# EasyEDA schematic LCD News Ticker.json
TITLE: LCD News Ticker; REV: 1.0; Date: 2021-03-30; Sheet: 1/1; Drawn By: Ferrie Bank; Company: Oude Snepelaar
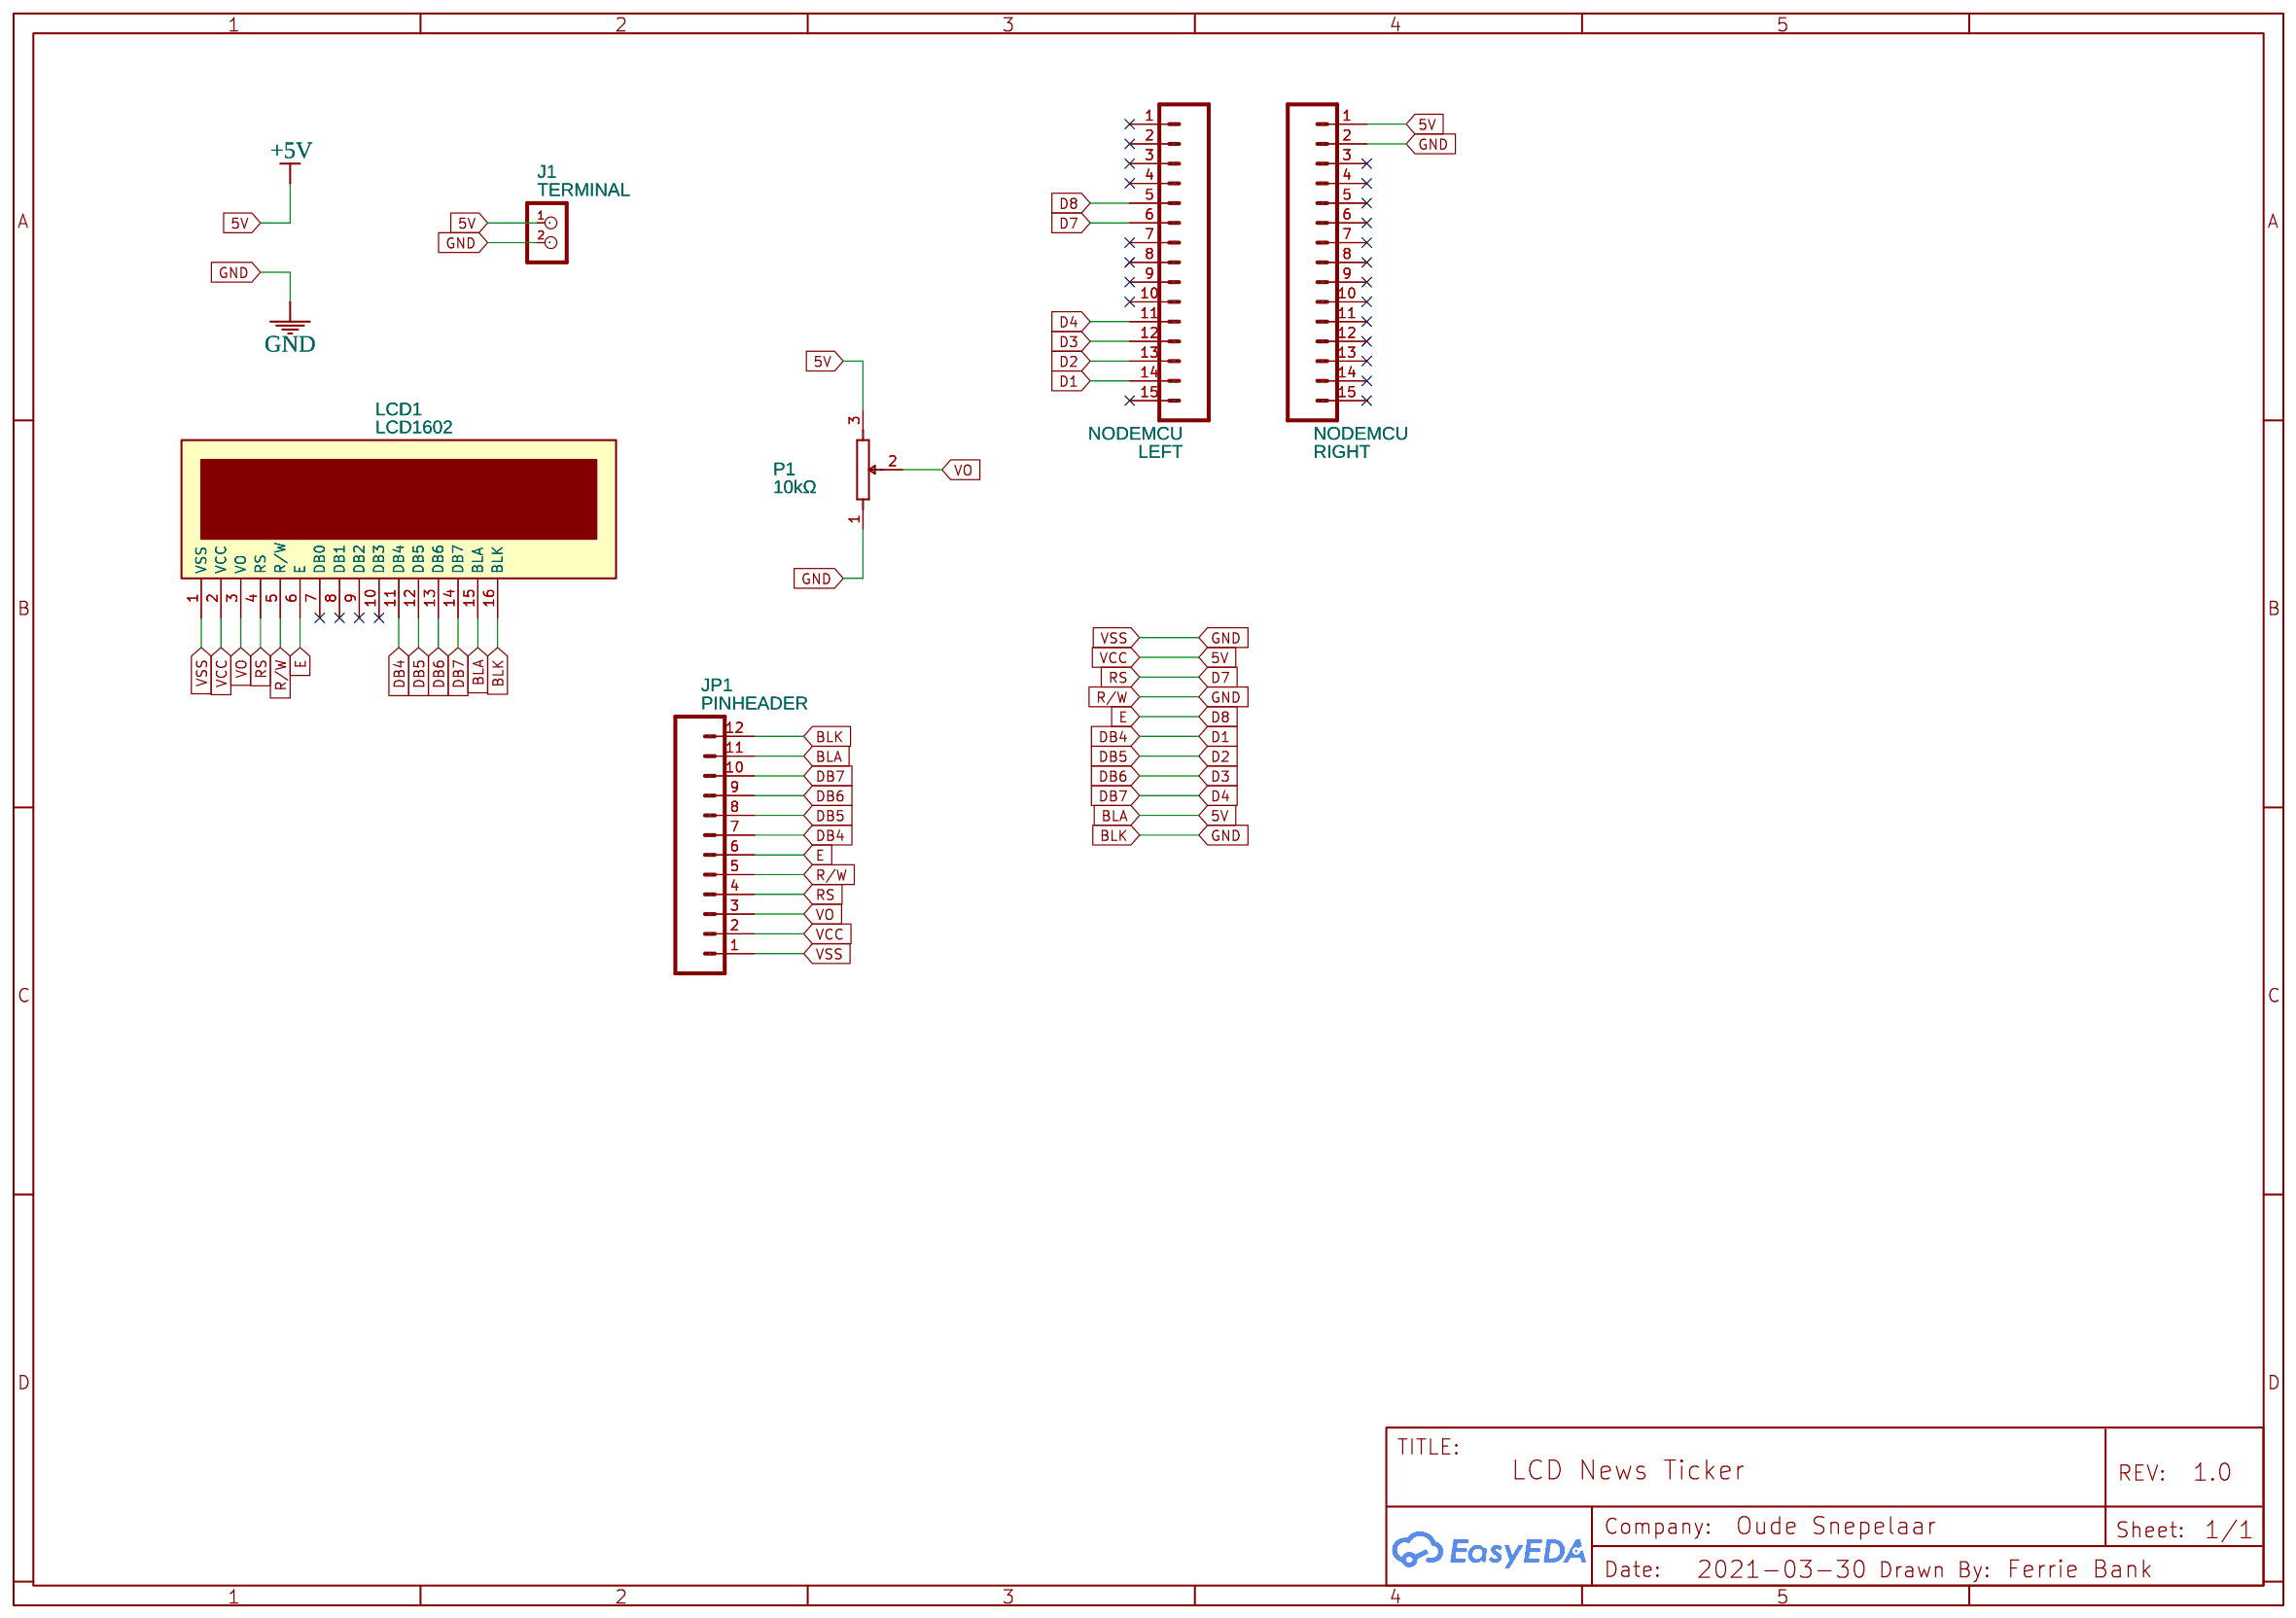
[diagram p0: schematic sheet]

## Parts
J1  TERMINAL  [TERMINAL_BLOCK_2P_5]
JP1  PINHEADER  [1X12]
LCD1  LCD1602  [LCD1602]
LEFT  NODEMCU  [1X15]
P1  10kΩ  [POTF_1]
RIGHT  NODEMCU  [1X15]

## Library data of the parts
J1 = CON_TERMINAL_BLOCK_02-5MM: 2 poles wire to board terminal block; Contributor: DangerousPrototype
JP1 = M12PTH: Header 12; Contributor: SparkFun
LCD1 = LCD1602: Manufacturer: LONTECH(厦门龙特); Manufacturer Part: LCM1602K-NSW-BBW; Supplier Part: C83275; Supplier: LCSC; Contributor: LCEDA_Lib
LEFT RIGHT = M15: Contributor: SparkFun
P1 = POTF_1

## Nets
+5V: J1.1 JP1.2 JP1.11 LCD1.2(VCC) LCD1.15(BLA) P1.3 RIGHT.1
BLK: J1.2 JP1.1 JP1.5 JP1.12 LCD1.1(VSS) LCD1.5(R/W) LCD1.16(BLK) P1.1 RIGHT.2
D1: JP1.7 LCD1.11(DB4) LEFT.14
D2: JP1.8 LCD1.12(DB5) LEFT.13
D3: JP1.9 LCD1.13(DB6) LEFT.12
D4: JP1.10 LCD1.14(DB7) LEFT.11
D7: JP1.4 LCD1.4(RS) LEFT.6
D8: JP1.6 LCD1.6(E) LEFT.5
VO: JP1.3 LCD1.3(VO) P1.2

Not connected (* = marked no-connect by the designer): LCD1 7(DB0)* 8(DB1)* 9(DB2)* 10(DB3)*; LEFT 1* 2* 3* 4* 7* 8* 9* 10* 15*; RIGHT 3* 4* 5* 6* 7* 8* 9* 10* 11* 12* 13* 14* 15*
